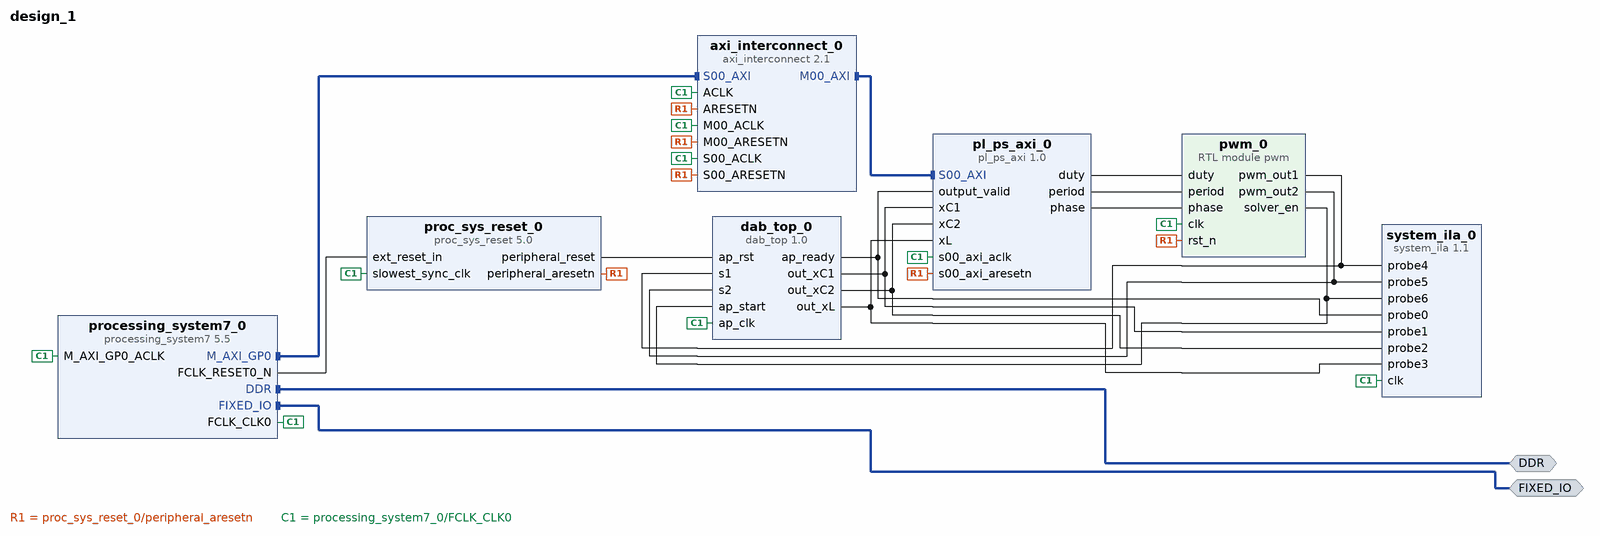
[diagram p0: block diagram of the top level]
# Vivado block design design_1, xc7z020clg400-1, Vivado 2023.1
create_bd_design design_1

create_bd_intf_port -mode Master -vlnv xilinx.com:interface:ddrx_rtl:1.0 DDR
create_bd_intf_port -mode Master -vlnv xilinx.com:display_processing_system7:fixedio_rtl:1.0 FIXED_IO

create_bd_cell -type ip -vlnv xilinx.com:ip:proc_sys_reset:5.0 proc_sys_reset_0
create_bd_cell -type ip -vlnv xilinx.com:ip:processing_system7:5.5 processing_system7_0
set_property -dict [list \
  CONFIG.PCW_APU_PERIPHERAL_FREQMHZ 650 \
  CONFIG.PCW_CRYSTAL_PERIPHERAL_FREQMHZ 50 \
  CONFIG.PCW_ENET0_PERIPHERAL_CLKSRC External \
  CONFIG.PCW_ENET0_PERIPHERAL_ENABLE 0 \
  CONFIG.PCW_ENET0_RESET_ENABLE 1 \
  CONFIG.PCW_ENET0_RESET_IO {MIO 9} \
  CONFIG.PCW_ENET_RESET_ENABLE 1 \
  CONFIG.PCW_FPGA0_PERIPHERAL_FREQMHZ 100 \
  CONFIG.PCW_FPGA1_PERIPHERAL_FREQMHZ 1 \
  CONFIG.PCW_GPIO_MIO_GPIO_ENABLE 1 \
  CONFIG.PCW_GPIO_MIO_GPIO_IO MIO \
  CONFIG.PCW_I2C_RESET_ENABLE 0 \
  CONFIG.PCW_M_AXI_GP0_FREQMHZ 10 \
  CONFIG.PCW_PERIPHERAL_BOARD_PRESET part0 \
  CONFIG.PCW_PRESET_BANK1_VOLTAGE {LVCMOS 1.8V} \
  CONFIG.PCW_QSPI_GRP_FBCLK_ENABLE 1 \
  CONFIG.PCW_QSPI_GRP_FBCLK_IO {MIO 8} \
  CONFIG.PCW_QSPI_GRP_SINGLE_SS_ENABLE 1 \
  CONFIG.PCW_QSPI_GRP_SINGLE_SS_IO {MIO 1 .. 6} \
  CONFIG.PCW_QSPI_PERIPHERAL_ENABLE 1 \
  CONFIG.PCW_QSPI_QSPI_IO {MIO 1 .. 6} \
  CONFIG.PCW_SD0_PERIPHERAL_ENABLE 0 \
  CONFIG.PCW_SDIO_PERIPHERAL_FREQMHZ 50 \
  CONFIG.PCW_SINGLE_QSPI_DATA_MODE x4 \
  CONFIG.PCW_UART0_PERIPHERAL_ENABLE 1 \
  CONFIG.PCW_UART0_UART0_IO {MIO 14 .. 15} \
  CONFIG.PCW_UART1_PERIPHERAL_ENABLE 0 \
  CONFIG.PCW_UART_PERIPHERAL_FREQMHZ 100 \
  CONFIG.PCW_UIPARAM_DDR_BUS_WIDTH {16 Bit} \
  CONFIG.PCW_UIPARAM_DDR_FREQ_MHZ 525 \
  CONFIG.PCW_UIPARAM_DDR_PARTNO {MT41J256M16 RE-125} \
  CONFIG.PCW_UIPARAM_GENERATE_SUMMARY NONE \
  CONFIG.PCW_USB0_PERIPHERAL_ENABLE 0 \
  CONFIG.PCW_USB0_RESET_ENABLE 1 \
  CONFIG.PCW_USB0_RESET_IO {MIO 46} \
  CONFIG.PCW_USB_RESET_ENABLE 1 \
] [get_bd_cells processing_system7_0]
# 479 more settings of processing_system7_0 are not shown: defaults, MIO pin electricals, DDR timing, and values the tool derives
create_bd_cell -type ip -vlnv xilinx.com:ip:axi_interconnect:2.1 axi_interconnect_0
set_property -dict {CONFIG.NUM_MI 1} [get_bd_cells axi_interconnect_0]
create_bd_cell -type ip -vlnv user.org:user:pl_ps_axi:1.0 pl_ps_axi_0
create_bd_cell -type ip -vlnv xilinx.com:hls:dab_top:1.0 dab_top_0
create_bd_cell -type ip -vlnv xilinx.com:ip:system_ila:1.1 system_ila_0
set_property -dict [list \
  CONFIG.C_DATA_DEPTH 16384 \
  CONFIG.C_MON_TYPE NATIVE \
  CONFIG.C_NUM_OF_PROBES 7 \
  CONFIG.C_PROBE0_TYPE 0 \
  CONFIG.C_PROBE1_TYPE 1 \
  CONFIG.C_PROBE2_TYPE 1 \
  CONFIG.C_PROBE3_TYPE 1 \
  CONFIG.C_PROBE4_TYPE 0 \
  CONFIG.C_PROBE5_TYPE 0 \
  CONFIG.C_PROBE6_TYPE 0 \
] [get_bd_cells system_ila_0]
create_bd_cell -type module -reference pwm pwm_0

# ---- connections ----

connect_bd_intf_net [get_bd_intf_pins axi_interconnect_0/M00_AXI] [get_bd_intf_pins pl_ps_axi_0/S00_AXI]
connect_bd_intf_net [get_bd_intf_ports DDR] [get_bd_intf_pins processing_system7_0/DDR]
connect_bd_intf_net [get_bd_intf_ports FIXED_IO] [get_bd_intf_pins processing_system7_0/FIXED_IO]
connect_bd_intf_net [get_bd_intf_pins processing_system7_0/M_AXI_GP0] [get_bd_intf_pins axi_interconnect_0/S00_AXI]
connect_bd_net -net dab_top_0_ap_ready [get_bd_pins dab_top_0/ap_ready] [get_bd_pins pl_ps_axi_0/output_valid] [get_bd_pins system_ila_0/probe0]
connect_bd_net -net dab_top_0_out_xC1 [get_bd_pins dab_top_0/out_xC1] [get_bd_pins pl_ps_axi_0/xC1] [get_bd_pins system_ila_0/probe1]
connect_bd_net -net dab_top_0_out_xC2 [get_bd_pins dab_top_0/out_xC2] [get_bd_pins pl_ps_axi_0/xC2] [get_bd_pins system_ila_0/probe2]
connect_bd_net -net dab_top_0_out_xL [get_bd_pins dab_top_0/out_xL] [get_bd_pins pl_ps_axi_0/xL] [get_bd_pins system_ila_0/probe3]
connect_bd_net [get_bd_pins pl_ps_axi_0/duty] [get_bd_pins pwm_0/duty]
connect_bd_net [get_bd_pins pl_ps_axi_0/period] [get_bd_pins pwm_0/period]
connect_bd_net [get_bd_pins pl_ps_axi_0/phase] [get_bd_pins pwm_0/phase]
connect_bd_net [get_bd_pins proc_sys_reset_0/peripheral_aresetn] \
  [get_bd_pins axi_interconnect_0/ARESETN] [get_bd_pins axi_interconnect_0/S00_ARESETN] \
  [get_bd_pins axi_interconnect_0/M00_ARESETN] [get_bd_pins pl_ps_axi_0/s00_axi_aresetn] [get_bd_pins pwm_0/rst_n]
connect_bd_net [get_bd_pins proc_sys_reset_0/peripheral_reset] [get_bd_pins dab_top_0/ap_rst]
connect_bd_net [get_bd_pins processing_system7_0/FCLK_CLK0] \
  [get_bd_pins axi_interconnect_0/ACLK] [get_bd_pins axi_interconnect_0/M00_ACLK] [get_bd_pins pl_ps_axi_0/s00_axi_aclk] \
  [get_bd_pins axi_interconnect_0/S00_ACLK] [get_bd_pins processing_system7_0/M_AXI_GP0_ACLK] \
  [get_bd_pins proc_sys_reset_0/slowest_sync_clk] [get_bd_pins dab_top_0/ap_clk] [get_bd_pins system_ila_0/clk] \
  [get_bd_pins pwm_0/clk]
connect_bd_net [get_bd_pins processing_system7_0/FCLK_RESET0_N] [get_bd_pins proc_sys_reset_0/ext_reset_in]
connect_bd_net -net pwm_0_pwm_out1 [get_bd_pins pwm_0/pwm_out1] [get_bd_pins dab_top_0/s1] [get_bd_pins system_ila_0/probe4]
connect_bd_net -net pwm_0_pwm_out2 [get_bd_pins pwm_0/pwm_out2] [get_bd_pins dab_top_0/s2] [get_bd_pins system_ila_0/probe5]
connect_bd_net -net pwm_0_solver_en [get_bd_pins pwm_0/solver_en] [get_bd_pins dab_top_0/ap_start] [get_bd_pins system_ila_0/probe6]
set_property PFM.CLOCK {FCLK_CLK0 {id "0" is_default "true" proc_sys_reset "/proc_sys_reset_0" status "fixed" freq_hz "100000000"}} [get_bd_cells processing_system7_0]
set_property PFM.AXI_PORT {M01_AXI {memport "M_AXI_GP" sptag "" memory "" is_range "false"}} [get_bd_cells axi_interconnect_0]
set_property HDL_ATTRIBUTE.DEBUG true [get_bd_nets dab_top_0_ap_ready]
set_property HDL_ATTRIBUTE.MARK_DEBUG true [get_bd_nets dab_top_0_ap_ready]
set_property HDL_ATTRIBUTE.DEBUG true [get_bd_nets dab_top_0_out_xC1]
set_property HDL_ATTRIBUTE.MARK_DEBUG true [get_bd_nets dab_top_0_out_xC1]
set_property HDL_ATTRIBUTE.DEBUG true [get_bd_nets dab_top_0_out_xC2]
set_property HDL_ATTRIBUTE.MARK_DEBUG true [get_bd_nets dab_top_0_out_xC2]
set_property HDL_ATTRIBUTE.DEBUG true [get_bd_nets dab_top_0_out_xL]
set_property HDL_ATTRIBUTE.MARK_DEBUG true [get_bd_nets dab_top_0_out_xL]
set_property HDL_ATTRIBUTE.DEBUG true [get_bd_nets pwm_0_pwm_out1]
set_property HDL_ATTRIBUTE.MARK_DEBUG true [get_bd_nets pwm_0_pwm_out1]
set_property HDL_ATTRIBUTE.DEBUG true [get_bd_nets pwm_0_pwm_out2]
set_property HDL_ATTRIBUTE.MARK_DEBUG true [get_bd_nets pwm_0_pwm_out2]
set_property HDL_ATTRIBUTE.DEBUG true [get_bd_nets pwm_0_solver_en]
set_property HDL_ATTRIBUTE.MARK_DEBUG true [get_bd_nets pwm_0_solver_en]

# ---- address map ----
assign_bd_address -offset 0x44A00000 -range 64K -target_address_space [get_bd_addr_spaces processing_system7_0/Data] [get_bd_addr_segs pl_ps_axi_0/S00_AXI/S00_AXI_reg]

validate_bd_design
save_bd_design
